# EAGLE design main_board (EAGLE 9.4.2)
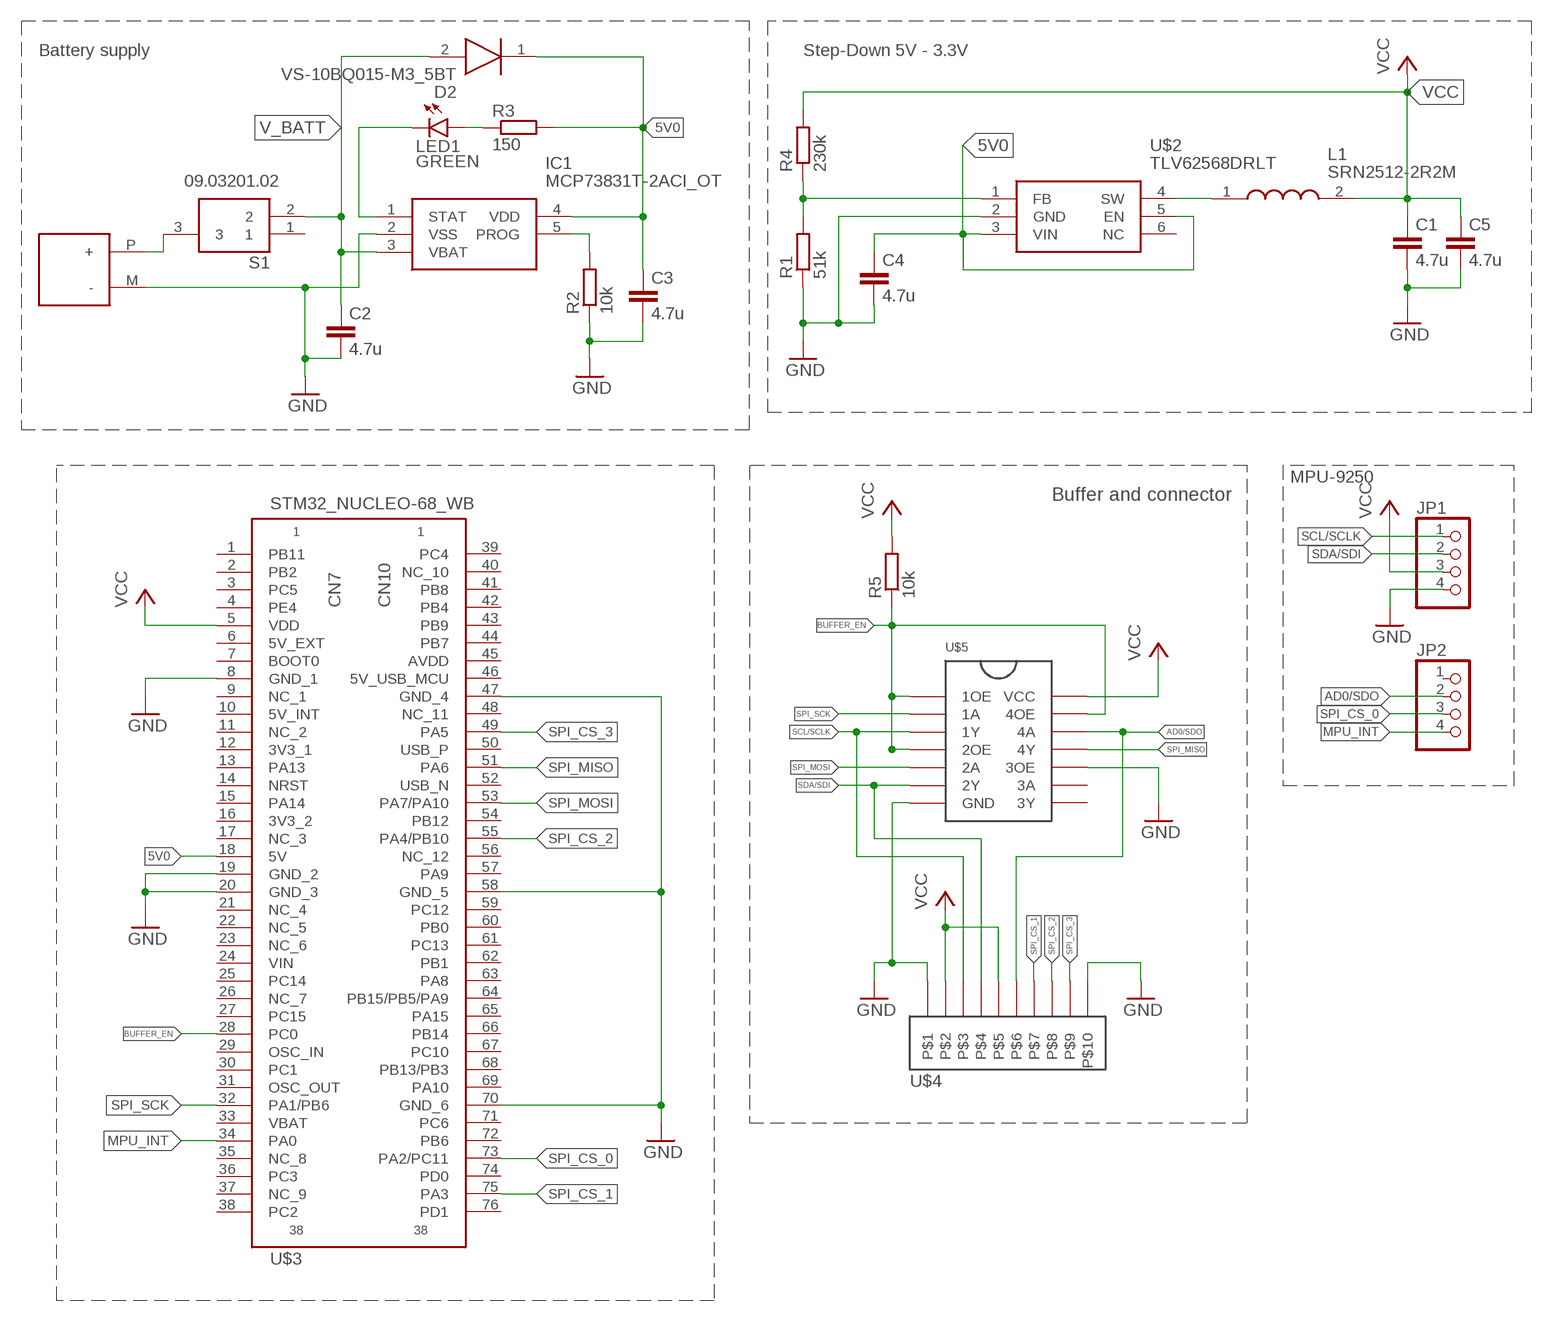
[diagram p0: schematic, sheet 1]

## Parts
C1  4.7u  C-EUC1206  [C1206]
C2  4.7u  C-EUC1206  [C1206]
C3  4.7u  C-EUC1206  [C1206]
C4  4.7u  C-EUC1206  [C1206]
C5  4.7u  C-EUC1206  [C1206]
D2  VS-10BQ015-M3_5BT  [DIOM5436X244N]
IC1  MCP73831T-2ACI_OT  [SOT95P270X145-5N]
JP1  PINHD-1X04_2.54-SMD  [1X04SMD]
JP2  PINHD-1X04_2.54-SMD  [1X04SMD]
L1  SRN2512-2R2M  [INDPM2622X120N]
LED1  GREEN  LEDCHIPLED_1206  [CHIPLED_1206]
R1  51k  R-EU_R1206  [R1206]
R2  10k  R-EU_R1206  [R1206]
R3  150  R-EU_R1206  [R1206]
R4  230k  R-EU_R1206  [R1206]
R5  10k  R-EU_R1206  [R1206]
S1  09.03201.02  [090320102]
U$1  BAT_FLAT_PAD  [BATTERY_FLAT_PAD]
U$2  TLV62568DRLT  [SOT563]
U$3  STM32_NUCLEO-68_WB  [STM32_NUCLEO-68_FOOTPRINT]
U$4  1-2178711-2  [1-2178712-0]
U$5  74AHC126D,118  [SOIC127P600X175-14N]

## Nets
5V0 [Vdd]: C3.1 C4.1 D2.1(K) IC1.4(VDD) R3.2 U$2.3(VIN) U$2.5(EN) U$3.18(5V)
AD0/SDO: JP2.2 U$4.P$6 U$5.12(4A)
BUFFER_EN: R5.1 U$3.28(PC0) U$5.1(1OE) U$5.4(2OE) U$5.13(4OE)
GND: C1.2 C2.2 C3.2 C4.2 C5.2 IC1.2(VSS) JP1.4 R1.1 R2.1 U$1.M(-) U$2.2(GND) U$3.8(GND_1) U$3.19(GND_2) U$3.20(GND_3) U$3.47(GND_4) U$3.58(GND_5) U$3.70(GND_6) U$4.P$1 U$4.P$10 U$5.7(GND) U$5.10(3OE)
MPU_INT: JP2.4 U$3.34(PA0)
N$1 [Wide]: LED1.A R3.1
N$2 [Wide]: IC1.1(STAT) LED1.C
N$3 [Wide]: IC1.5(PROG) R2.2
N$4: S1.3 U$1.P(+)
N$6 [Vdd]: L1.1 U$2.4(SW)
N$8: R1.2 R4.1 U$2.1(FB)
SCL/SCLK: JP1.1 U$4.P$3 U$5.3(1Y)
SDA/SDI: JP1.2 U$4.P$4 U$5.6(2Y)
SPI_CS_0: JP2.3 U$3.73(PA2/PC11)
SPI_CS_1: U$3.75(PA3) U$4.P$7
SPI_CS_2: U$3.55(PA4/PB10) U$4.P$8
SPI_CS_3: U$3.49(PA5) U$4.P$9
SPI_MISO: U$3.51(PA6) U$5.11(4Y)
SPI_MOSI: U$3.53(PA7/PA10) U$5.5(2A)
SPI_SCK: U$3.32(PA1/PB6) U$5.2(1A)
V_BATT: C2.1 D2.2(A) IC1.3(VBAT) S1.2
VCC [Vdd]: C1.1 C5.1 JP1.3 L1.2 R4.2 R5.2 U$3.5(VDD) U$4.P$2 U$4.P$5 U$5.14(VCC)
Unconnected: JP2.1 S1.1 U$2.6(NC) U$3.1(PB11) U$3.2(PB2) U$3.3(PC5) U$3.4(PE4) U$3.6(5V_EXT) U$3.7(BOOT0) U$3.9(NC_1) U$3.10(5V_INT) U$3.11(NC_2) U$3.12(3V3_1) U$3.13(PA13) U$3.14(NRST) U$3.15(PA14) U$3.16(3V3_2) U$3.17(NC_3) U$3.21(NC_4) U$3.22(NC_5) U$3.23(NC_6) U$3.24(VIN) U$3.25(PC14) U$3.26(NC_7) U$3.27(PC15) U$3.29(OSC_IN) U$3.30(PC1) U$3.31(OSC_OUT) U$3.33(VBAT) U$3.35(NC_8) U$3.36(PC3) U$3.37(NC_9) U$3.38(PC2) U$3.39(PC4) U$3.40(NC_10) U$3.41(PB8) U$3.42(PB4) U$3.43(PB9) U$3.44(PB7) U$3.45(AVDD) U$3.46(5V_USB_MCU) U$3.48(NC_11) U$3.50(USB_P) U$3.52(USB_N) U$3.54(PB12) U$3.56(NC_12) U$3.57(PA9) U$3.59(PC12) U$3.60(PB0) U$3.61(PC13) U$3.62(PB1) U$3.63(PA8) U$3.64(PB15/PB5/PA9) U$3.65(PA15) U$3.66(PB14) U$3.67(PC10) U$3.68(PB13/PB3) U$3.69(PA10) U$3.71(PC6) U$3.72(PB6) U$3.74(PD0) U$3.76(PD1) U$5.8(3Y) U$5.9(3A)

## Notes on the sheet
- Battery supply | Step-Down 5V - 3.3V
- MPU-9250
- Buffer and connector

## Library data of the parts
C1-C5 = resistor:C-EU: CAPACITOR, European symbol
D2 = SamacSys_Parts:VS-10BQ015-M3_5BT: VS-10BQ015-M3/5BT Vishay SMT Schottky Diode, 15V 1A, 2-Pin DO-214AA (SMB) Source: Datasheet <https://componentsearchengine.com/Datasheets/1/VS-10BQ015-M3_5BT.pdf>; DESCRIPTION: VS-10BQ015-M3/5BT Vishay SMT Schottky Diode, 15V 1A, 2-Pin DO-214AA (SMB); HEIGHT: 2.44mm; MANUFACTURER_NAME: Vishay; MANUFACTURER_PART_NUMBER: VS-10BQ015-M3/5BT; MOUSER_PART_NUMBER: 78-VS-10BQ015-M35BT; MOUSER_PRICE-STOCK: https://www.mouser.com/Search/Refine.aspx?Keyword=78-VS-10BQ015-M35BT
IC1 = SamacSys_Parts:MCP73831T-2ACI_OT: Li-Ion Charge Controller 4.2V SOT23-5 Source: Datasheet <https://componentsearchengine.com/Datasheets/1/MCP73831T-2ACI_OT.pdf>; DESCRIPTION: Li-Ion Charge Controller 4.2V SOT23-5; HEIGHT: 1.45mm; MANUFACTURER_NAME: Microchip; MANUFACTURER_PART_NUMBER: MCP73831T-2ACI/OT; MOUSER_PART_NUMBER: 579-MCP73831T-2ACIOT; MOUSER_PRICE-STOCK: https://www.mouser.com/Search/Refine.aspx?Keyword=579-MCP73831T-2ACIOT
JP1 JP2 = pinhead-2:PINHD-1X04: PIN HEADER
L1 = SamacSys_Parts:SRN2512-2R2M: Bourns SRN2512 Series Shielded Wire-wound SMD Inductor with a Ferrite Core, 2.2 uH +/-20% 2.3A Idc Source: Datasheet <https://componentsearchengine.com/Datasheets/1/SRN2512-2R2M.pdf>; DESCRIPTION: Bourns SRN2512 Series Shielded Wire-wound SMD Inductor with a Ferrite Core, 2.2 uH +/-20% 2.3A Idc; HEIGHT: 1.2mm; MANUFACTURER_NAME: Bourns; MANUFACTURER_PART_NUMBER: SRN2512-2R2M; MOUSER_PART_NUMBER: 652-SRN2512-2R2M; MOUSER_PRICE-STOCK: https://www.mouser.com/Search/Refine.aspx?Keyword=652-SRN2512-2R2M
LED1 = led:LED: LED OSRAM: - CHIPLED LG R971, LG N971, LY N971, LG Q971, LY Q971, LO R971, LY R971 LH N974, LH R974 LS Q976, LO Q976, LY Q976 LO Q996 - Hyper CHIPLED LW Q18S LB Q993, LB Q99A, LB R99A - SideLED LS A670, LO A670, LY A670, LG A670, LP A670 LB A673, LV A673, LT A673, LW A673 LH A674 LY A675 LS A676, LA A676, LO A676, LY A676, LW A676 LS A679, LY A679, LG A679 - Hyper Micro SIDELED® LS Y876, LA Y876, LO Y876, LY Y876 LT Y87S - SmartLED LW L88C, LW L88S LB L89C, LB L89S, LG L890 LS L89K, LO L89K, LY L89K LS L896, LA L896, LO L896, LY L896 - TOPLED LS T670, LO T670, LY T670, LG T670, LP T670 LSG T670, LSP T670, LSY T670, LOP T670, LYG T670 LG T671, LOG T671, LSG T671 LB T673, LV T673, LT T673, LW T673 LH T674 LS T676, LA T676, LO T676, LY T676, LB T676, LH T676, LSB T676, LW T676 LB T67C, LV T67C, LT T67C, LS T67K, LO T67K, LY T67K, LW E67C LS E67B, LA E67B, LO E67B, LY E67B, LB E67C, LV E67C, LT E67C LW T67C LS T679, LY T679, LG T679 LS T770, LO T770, LY T770, LG T770, LP T770 LB T773, LV T773, LT T773, LW T773 LH T774 LS E675, LA E675, LY E675, LS T675 LS T776, LA T776, LO T776, LY T776, LB T776 LHGB T686 LT T68C, LB T68C - Hyper Mini TOPLED® LB M676 - Mini TOPLED Santana® LG M470 LS M47K, LO M47K, LY M47K Source: http://www.osram.convergy.de LUXEON: - LUMILED® LXK2-PW12-R00, LXK2-PW12-S00, LXK2-PW14-U00, LXK2-PW14-V00 LXK2-PM12-R00, LXK2-PM12-S00, LXK2-PM14-U00 LXK2-PE12-Q00, LXK2-PE12-R00, LXK2-PE12-S00, LXK2-PE14-T00, LXK2-PE14-U00 LXK2-PB12-K00, LXK2-PB12-L00, LXK2-PB12-M00, LXK2-PB14-N00, LXK2-PB14-P00, LXK2-PB14-Q00 LXK2-PR12-L00, LXK2-PR12-M00, LXK2-PR14-Q00, LXK2-PR14-R00 LXK2-PD12-Q00, LXK2-PD12-R00, LXK2-PD12-S00 LXK2-PH12-R00, LXK2-PH12-S00 LXK2-PL12-P00, LXK2-PL12-Q00, LXK2-PL12-R00 Source: www.luxeon.com KINGBRIGHT: KA-3528ASYC Source: www.kingbright.com
R1-R5 = resistor:R-EU_: RESISTOR, European symbol
S1 = SamacSys_Parts:09.03201.02: 2 Way Through Hole SIP Switch SPST Source: Datasheet <https://componentsearchengine.com/Datasheets/2/09.03201.02.pdf>; DESCRIPTION: 2 Way Through Hole SIP Switch SPST; HEIGHT: 5mm; MANUFACTURER_NAME: EOZ; MANUFACTURER_PART_NUMBER: 09.03201.02; RS_PART_NUMBER: 1156283P; RS_PRICE-STOCK: http://uk.rs-online.com/web/p/products/1156283P
U$1 = connector:BAT_FLAT_PAD
U$2 = SamacSys_Parts:TLV62568DRLT
U$3 = STM32WB:STM32_NUCLEO-68_WB
U$4 = SamacSys_Parts:1-2178711-2
U$5 = SamacSys_Parts:74AHC126D,118

## Net classes
0 default: width 0.152 mm, drill 0.3 mm, clearance 0.152 mm
1 Wide: width 0.61 mm, clearance 0.152 mm
2 Vdd: width 0.305 mm, clearance 0.152 mm

## Board
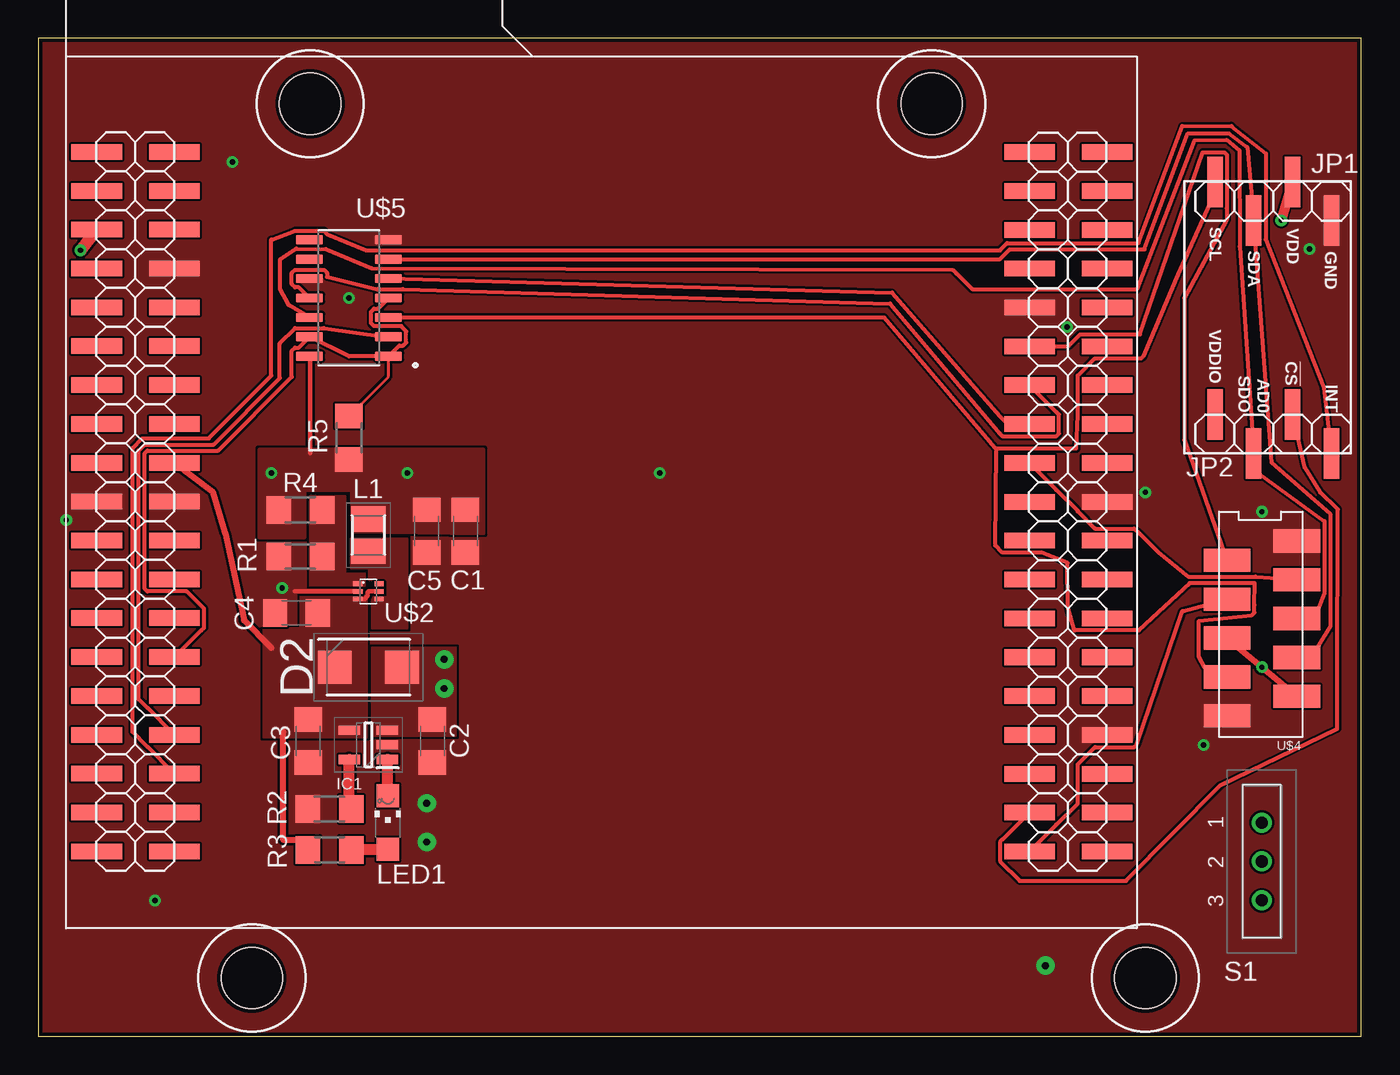
[diagram p1: board, top side]
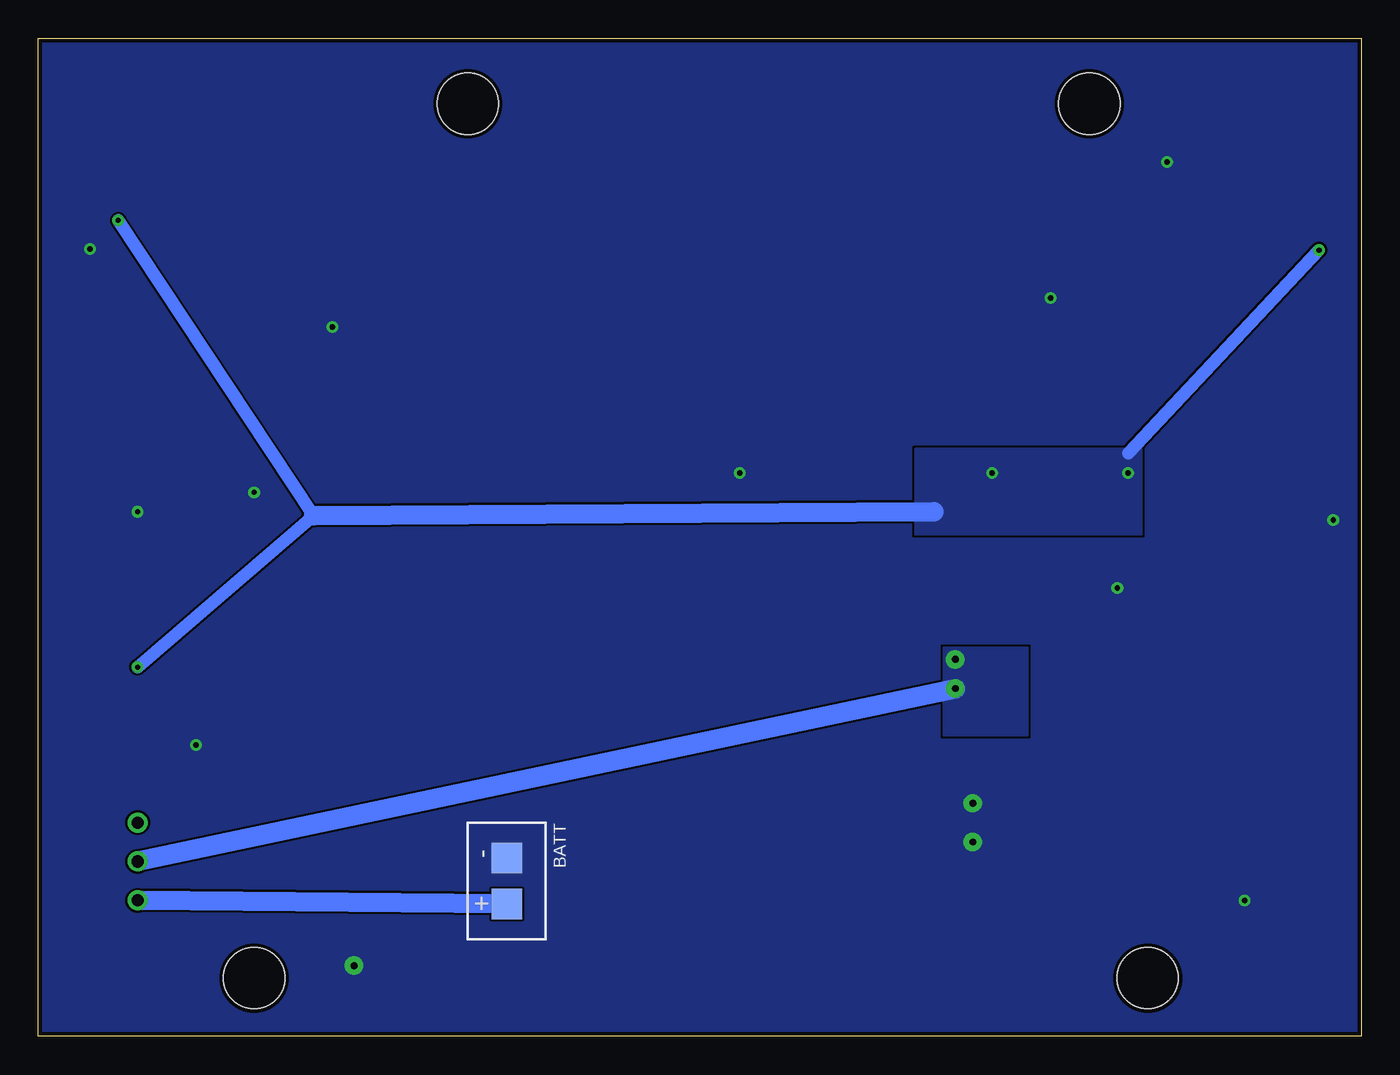
[diagram p2: board, bottom side, seen from below]

Size 86.51 x 65.24 mm. Coordinates in mm from the lower left corner, seen from the top.
Outline: 0,0 86.51,0 86.51,65.24 0,65.24 0,0
Copper layers (1*16): Top 0.035mm / dielectric 1.6mm / Bottom 0.035mm
Design rules "default *": minimum track width 6mil, minimum drill 0.35mm, track to track 6mil, track to pad 6mil, pad to pad 6mil, via to via 6mil, smd to smd 6mil, copper to edge 10mil, drill to drill 8mil, minimum pad ring 10mil, minimum via ring 8mil, stop-mask expansion 4mil, vias tented up to drill 0mil, thermal gap 10mil
Holes 4 mm at 13.97,3.81 72.39,3.81 58.42,60.96 17.78,60.96

### Footprints (pad centres in the part's own frame; a part is rotated, then mirrored left to right if it is on the bottom)
C1206 = smd 1.6 x 1.8: 1 -1.4,0; 2 1.4,0
DIOM5436X244N = smd 2.2 x 2.15: 1 -2.2,0; 2 2.2,0
SOT95P270X145-5N = smd 1.4 x 0.6: 1 -1.25,0.95; 2 -1.25,0; 3 -1.25,-0.95; 4 1.25,-0.95; 5 1.25,0.95
1X04SMD = smd 1.016 x 3.302: 1 -1.27,1.27; 2 1.27,-1.27; 3 3.81,1.27; 4 6.35,-1.27
INDPM2622X120N = smd 1.65 x 2.25: 1 -1.05,0; 2 1.05,0
CHIPLED_1206 = smd 1.5 x 1.5: A 0,-1.75; C 0,1.75
R1206 = smd 1.6 x 1.803: 1 -1.422,0; 2 1.422,0
090320102 = drill 0.8 pad 1.3: 1 -2.54,0; 2 0,0; 3 2.54,0
BATTERY_FLAT_PAD = smd 2 x 2: M 1.5,0; P -1.5,0
SOT563 = smd 0.305 x 0.61: 1 -0.5,-0.7; 2 0,-0.7; 3 0.5,-0.7; 4 0.5,0.7; 5 0,0.7; 6 -0.5,0.7
STM32_NUCLEO-68_FOOTPRINT = smd 3.302 x 1.016: 1 -33.006,22.25; 2 -27.926,22.25; 3 -33.006,19.71; 4 -27.926,19.71; 5 -33.006,17.17; 6 -27.926,17.17; 7 -33.006,14.63; 8 -27.926,14.63; 9 -33.006,12.09; 10 -27.926,12.09; 11 -33.006,9.55; 12 -27.926,9.55; 13 -33.006,7.01; 14 -27.926,7.01; 15 -33.006,4.47; 16 -27.926,4.47; 17 -33.006,1.93; 18 -27.926,1.93; 19 -33.006,-0.61; 20 -27.926,-0.61; 21 -33.006,-3.15; 22 -27.926,-3.15; 23 -33.006,-5.69; 24 -27.926,-5.69; 25 -33.006,-8.23; 26 -27.926,-8.23; 27 -33.006,-10.77; 28 -27.926,-10.77; 29 -33.006,-13.31; 30 -27.926,-13.31; 31 -33.006,-15.85; 32 -27.926,-15.85; 33 -33.006,-18.39; 34 -27.926,-18.39; 35 -33.006,-20.93; 36 -27.926,-20.93; 37 -33.006,-23.47; 38 -27.926,-23.47; 39 27.988,22.24; 40 33.068,22.24; 41 27.988,19.7; 42 33.068,19.7; 43 27.988,17.16; 44 33.068,17.16; 45 27.988,14.62; 46 33.068,14.62; 47 27.988,12.08; 48 33.068,12.08; 49 27.988,9.54; 50 33.068,9.54; 51 27.988,7; 52 33.068,7; 53 27.988,4.46; 54 33.068,4.46; 55 27.988,1.92; 56 33.068,1.92; 57 27.988,-0.62; 58 33.068,-0.62; 59 27.988,-3.16; 60 33.068,-3.16; 61 27.988,-5.7; 62 33.068,-5.7; 63 27.988,-8.24; 64 33.068,-8.24; 65 27.988,-10.78; 66 33.068,-10.78; 67 27.988,-13.32; 68 33.068,-13.32; 69 27.988,-15.86; 70 33.068,-15.86; 71 27.988,-18.4; 72 33.068,-18.4; 73 27.988,-20.94; 74 33.068,-20.94; 75 27.988,-23.48; 76 33.068,-23.48
1-2178712-0 = smd 1.524 x 3.048: P$1 -5.715,2.286; P$2 -4.445,-2.286; P$3 -3.175,2.286; P$4 -1.905,-2.286; P$5 -0.635,2.286; P$6 0.635,-2.286; P$7 1.905,2.286; P$8 3.175,-2.286; P$9 4.445,2.286; P$10 5.715,-2.286
SOIC127P600X175-14N = smd 1.75 x 0.59: 1 -2.585,3.81; 2 -2.585,2.54; 3 -2.585,1.27; 4 -2.585,0; 5 -2.585,-1.27; 6 -2.585,-2.54; 7 -2.585,-3.81; 8 2.585,-3.81; 9 2.585,-2.54; 10 2.585,-1.27; 11 2.585,0; 12 2.585,1.27; 13 2.585,2.54; 14 2.585,3.81

### Placement (x,y rotation side)
C1  27.94,33.02 270 top
C2  25.78,19.3 270 top
C3  17.65,19.3 270 top
C4  16.89,27.69 180 top
C5  25.4,33.02 270 top
D2  21.59,24.13 0 top
IC1  21.59,19.05 180 top
JP1  78.21,54.58 0 top
JP2  78.21,39.37 0 top
L1  21.59,32.77 90 top
LED1  22.86,13.97 0 top
R1  17.14,31.37 0 top
R2  19.05,14.86 0 top
R3  19.05,12.19 180 top
R4  17.14,34.42 180 top
R5  20.32,39.12 270 top
S1  80.01,11.43 270 top
U$1  55.88,10.16 90 bottom
U$2  21.59,29.08 270 top
U$3  36.83,35.56 0 top
U$4  80.01,26.67 90 top
U$5  20.32,48.26 180 top

### Tracks (layer width: path | path; a pad name or v marks a point on that pad's centre or on a via)
5V0
  Top 0.305: U$2.5 21.59,29.08 21.55,29.04 21.55,28.78 21.34,28.57 U$2.3
  Top 0.406: R3.2 17.63,12.83 16.02,12.83 16.02,19.89 | 15.24,25.4 13.45,27.19 12.21,32.91 11.43,35.56 U$3.18
  pour Top (no thermals): 14.73,19.56 21.46,19.56 21.46,28.83 17.14,28.83 17.14,26.67 14.73,26.67
AD0/SDO
  Top 0.254: U$4.P$6 83.52,27.89 83.66,27.89 84.1,28.97 84.1,33.67 79.48,37.02 JP2.2 78.56,51.61 78.54,57.92 77.7,58.6 75.61,58.57 71.87,48.83 61.07,48.83 60.03,49.87 59.8,50.1 21.79,50.22 18.81,51.46 16.86,51.49 15.82,50.8 15.82,48.82 16.37,47.81 U$5.12
BUFFER_EN
  Top 0.203: R5.1 22.91,43.12 U$5.1
  Top 0.254: U$3.28 10.66,26.54 10.67,26.54 10.83,26.71 10.83,27.95 9.71,29.08 7.14,29.08 6.97,29.25 6.97,38.11 7.14,38.28 11.76,38.28 16.58,43.1 16.58,44.82 16.79,45.02 17.04,45.02 U$5.13 20.32,44.45 U$5.1 23.6,45.15 23.85,45.15 24.06,45.35 24.06,46.09 23.73,46.42 21.96,46.42 21.75,46.62 21.75,47.36 21.96,47.56 22.21,47.56 U$5.4
GND  (via drill 0.35, 0.45 pad 1.2)
  Top 0.305: U$2.2 16.76,29.08
  other vias: 25.4,12.7 25.4,15.24 65.86,4.62 80.01,34.29 67.28,46.35 76.2,19.05 15.95,29.31 72.39,35.56 12.7,57.15 83.13,51.46 7.62,8.89 40.64,36.83 20.32,48.26 1.83,33.76
  pour Top (rank 2, no thermals): 27.3,10.16 27.3,19.38 21.84,19.38 21.59,19.18 21.59,18.54 24.13,18.54 24.13,10.16
  pour Top (rank 2, no thermals): 21.59,19.3 16.51,19.3 16.51,13.59 19.3,13.59 19.3,18.54 21.59,18.54
  pour Top (rank 6, no thermals): 0,65.23 86.51,65.23 86.51,0.03 0.1,0.03 0,0.13
  pour Bottom (rank 6, no thermals): 0,65.23 86.51,65.23 86.49,0.03 0,0
MPU_INT
  Top 0.254: U$3.34 7.15,18.92 7.14,18.92 6.16,19.9 6.16,38.45 6.8,39.09 11.15,39.09 15.24,43.18 15.24,52.07 15.25,52.07 16.79,52.64 18.68,52.64 18.89,52.44 21.43,51.37 62.88,51.37 63.35,51.84 71.94,51.84 74.8,59.49 78.01,59.51 arc-90 78.01,59.49 80.27,57.71 80.26,52.07 84.07,42.39 JP2.4
N$1
  Top 0.711: LED1.A arc-90 22.83,12.19 R3.1
N$2
  Top 0.711: LED1.C 22.86,18.1 IC1.1
N$3
  Top 0.711: R2.2 arc90 20.34,14.99 IC1.5
N$4
  Bottom 1.27: U$1.P S1.3
N$6
  pour Top (no thermals): 21.84,28.7 22.86,28.7 22.86,29.84 21.64,29.84 21.64,30.61 20.45,30.61 20.45,32.51 24.13,32.51 24.13,26.67 21.84,26.67
N$8
  Top 0.305: 18.57,31.5 R1.2
  pour Top (no thermals): 17.78,29.46 21.34,29.46 21.34,30.23 20.07,30.23 20.07,35.31 17.78,35.31
SCL/SCLK
  Top 0.254: U$5.3 55.29,46.99 62.57,38.44 62.65,38.39 | JP1.1 76.59,54.38 74.55,49.82 72.29,44.48 72.12,44.31 69.1,44.31 67.97,43.18 67.97,40.62 67.88,38.42 62.65,38.39 | U$4.P$3 76.43,24.08 76.29,24.08 75.89,24.8 75.89,27.15 79.36,27.53 79.53,27.7 79.53,28.18 79.54,29.62 75.29,29.62 71.97,26.53 67.75,26.53 67.33,28.07 67.31,30.94 65.62,31.61 63.05,31.61 62.57,32.09 62.65,38.39
SDA/SDI
  Top 0.254: U$5.6 62.88,50.8 63.52,51.44 72.34,51.44 75.18,59.03 77.85,59.03 79.05,58.12 JP1.2 80.64,37.51 84.51,34.13 84.51,26.83 83.58,25.3 83.44,25.3 U$4.P$4
SPI_CS_0
  Top 0.254: U$3.73 63.06,12.87 63.05,12.87 62.89,12.7 62.89,11.46 64.18,10.16 71.12,10.16 77.29,16.41 84.94,20.09 84.93,23.02 84.98,34.45 83.82,35.56 82.8,37.19 JP2.3
SPI_CS_1
  Top 0.254: U$4.P$7 74.81,27.79 71.83,19.09 71.83,19.08 71.67,18.91 69.1,18.91 67.97,17.78 67.97,15.21 66.58,13.83 66.57,13.83 U$3.75
SPI_CS_2
  Top 0.254: U$3.55 66.57,35.73 66.58,35.73 67.97,34.34 67.97,34.32 69.1,33.19 71.67,33.19 71.98,32.87 73.25,31.63 75.19,30.05 79.6,30.05 82.47,29.84 U$4.P$8
SPI_CS_3
  Top 0.254: U$3.49 67.34,45.1 68.13,45.89 72.03,45.89 76.14,57.78 77.56,57.78 77.72,57.62 77.72,54.09 77.72,54.17 77.72,53.39 74.93,48.26 74.93,38.99 U$4.P$9
SPI_MISO
  Top 0.254: U$5.11 17.04,48.96 16.79,48.96 16.58,49.16 16.58,49.9 16.79,50.1 18.68,50.1 18.89,49.9 18.89,49.64 22.16,48.83 23.85,48.83 55.69,47.9 62.89,39.4 63.05,39.23 66.58,39.23 66.75,39.4 66.75,40.64 66.58,40.81 66.57,40.81 U$3.51
SPI_MOSI
  Top 0.254: U$5.5 22.84,49.55 55.83,48.61 62.84,40.58 63.4,40.02 U$3.53
SPI_SCK
  Top 0.254: U$3.32 7.15,21.46 7.14,21.46 6.57,22.03 6.57,38.28 6.97,38.68 11.46,38.68 15.79,43.02 15.79,45.3 16.79,46.29 18.68,46.29 22.65,45.72 U$5.2
V_BATT  (via drill 0.45 pad 1.2)
  Bottom 1.27: S1.2 v26.54,22.73
  other vias: 26.54,24.64
  pour Top (no thermals): 27.28,19.63 27.3,25.4 21.84,25.4 21.82,19.61
  pour Bottom (no thermals): 21.84,25.4 27.3,25.4 27.3,19.68 21.84,19.68
VCC  (via drill 0.35)
  Top 0.305: U$5.14 17.78,44.41 17.78,38.1
  Top 0.406: U$4.P$2 v80.02,24.12 U$4.P$5
  Top 0.61: v80.01,24.13 v80.02,24.12 | v81.28,53.34 JP1.3
  Top 0.813: v2.77,51.38 U$3.5
  Bottom 0.813: v2.77,51.38 15.24,38.1 | v80.01,24.13 68.5,34.04 v81.28,53.34
  Bottom 1.27: 27.94,34.29 68.5,34.04
  other vias: 15.24,36.83 24.13,36.83
  pour Top (no thermals): 20.57,33.02 29.08,32.89 29.08,38.35 14.48,38.35 14.48,32.64 17.4,32.64 17.4,35.71 20.52,35.69
  pour Bottom: 14.4,38.4 14.4,32.82 29.13,32.82 29.13,38.4

### Text on the board
tPlace: SCL | VDD | SDA | GND | VDDIO | !CS | AD0 / SDO | INT | 1 | 2 | 3
bNames: BATT
bDocu: Praca Magisterska / AGH, Elektronika i Telekomunikacja, Systemy Wbudowane / Autor: Damian Świerk / 2019